# EAGLE schematic Schematic v2 (EAGLE 9.6.2)
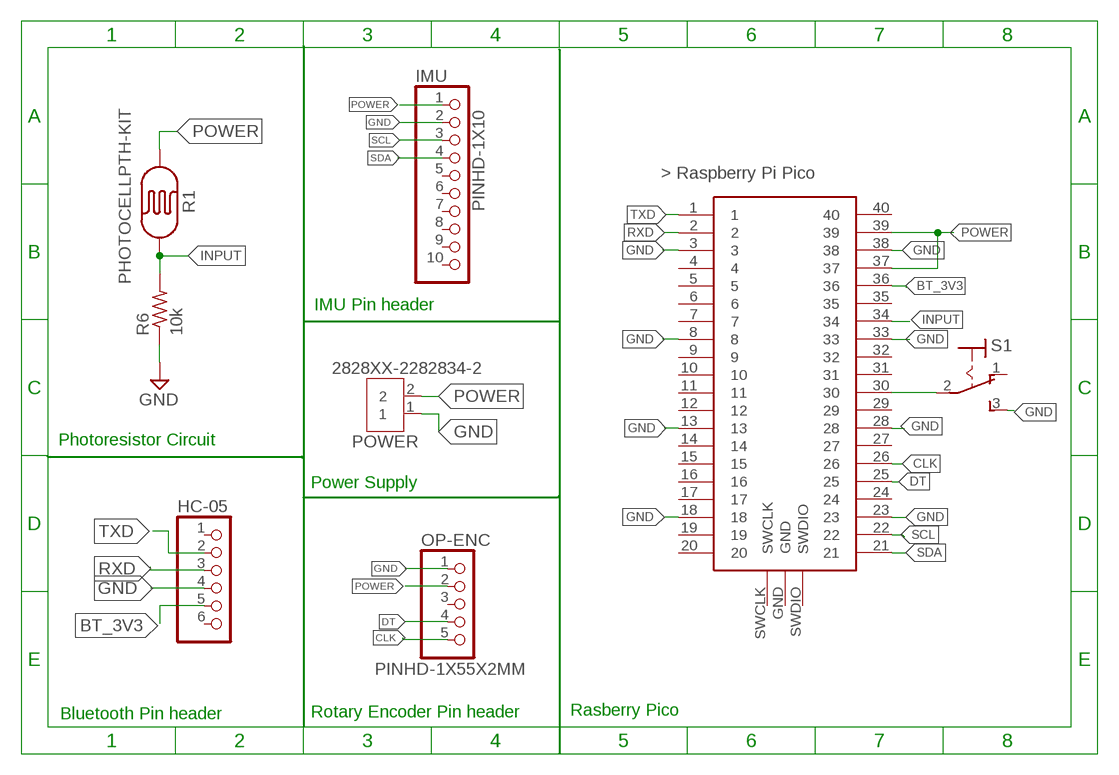
[diagram p0: schematic, sheet 1]

## Parts
HC-05  PINHD-1X6  [1X06]
IMU  PINHD-1X10  [1X10-BIG]
OP-ENC  PINHD-1X55X2MM  [1_05X2MM]
PICO  RASPBERRY-PI-PICO_TH  [FT_RASPBERRY-PI-PICO_TH]
POWER  2828XX-2282834-2  [TERMBLK_254-2N]
R1  PHOTOCELLPTH-KIT  [PHOTOCELL-KIT]
R6  10k  RESISTOR_1/4W_0207/10  [0207/10]
S1  320-916  [320-916]

## Nets
BT_3V3: HC-05.5 PICO.36
CLK: OP-ENC.5 PICO.26
DT: OP-ENC.4 PICO.25
GND: HC-05.4 IMU.2 OP-ENC.1 PICO.3 PICO.8 PICO.13 PICO.18 PICO.23 PICO.28 PICO.33 PICO.38 POWER.1 R6.1 S1.3(S)
INPUT: PICO.34 R1.1 R6.2
N$1: PICO.30 S1.2(P)
POWER: IMU.1 OP-ENC.2 PICO.37 PICO.39 POWER.2 R1.2
RXD: HC-05.3 PICO.2
SCL: IMU.3 PICO.22
SDA: IMU.4 PICO.21
TXD: HC-05.2 PICO.1
Unconnected: HC-05.1 HC-05.6 IMU.5 IMU.6 IMU.7 IMU.8 IMU.9 IMU.10 OP-ENC.3 PICO.4 PICO.5 PICO.6 PICO.7 PICO.9 PICO.10 PICO.11 PICO.12 PICO.14 PICO.15 PICO.16 PICO.17 PICO.19 PICO.20 PICO.24 PICO.27 PICO.29 PICO.31 PICO.32 PICO.35 PICO.40 PICO.GND PICO.SWCLK PICO.SWDIO S1.1(O)

## Notes on the sheet
- IMU Pin header
- Photoresistor Circuit
- Power Supply
- Bluetooth Pin header | Rotary Encoder Pin header | Rasberry Pico

## Library data of the parts
HC-05 = adafruit:PINHD-1X6: PIN HEADER
IMU = adafruit:PINHD-1X10: Pin header 1x10 0.1" spacing With round pins
OP-ENC = Connector:PINHD-1X5: PIN HEADER; CATEGORY: CONNECTOR; SUB-CATEGORY: PIN-HEADER
PICO = pipico:RASPBERRY-PI-PICO_TH: Raspberry Pi Pico microcontroller board for through-hole mounting.
POWER = Connector:2828XX-2: 2 Position Wire to Board Terminal Block Horizontal with Board Datasheet <https://www.te.com.cn/commerce/DocumentDelivery/DDEController?Action=showdoc&DocId=Catalog+Section%7F1308389_EUROSTYLE_TERMINAL_BLOCKS%7F0607%7Fpdf%7FEnglish%7FENG_CS_1308389_EUROSTYLE_TERMINAL_BLOCKS_0607.pdf%7F2-282837-5>
R1 = SparkFun-Sensors:PHOTOCELL: CdS photoresistor. This is a low cost way to detect light levels. Resistance decreases with more incoming light. SparkFun SKU: SEN-09088
R6 = BASIC_Components:RESISTOR_1/4W_0207/10
S1 = switch:320-916: TOGGLE SWITCH distributor RS Components